# EasyEDA schematic LOVE LED CARD_2021-05-20.json
TITLE: Sheet_1; REV: 1.0; Date: 2021-01-27; Sheet: 1/1; Drawn By: Kundi; Company: Your Company
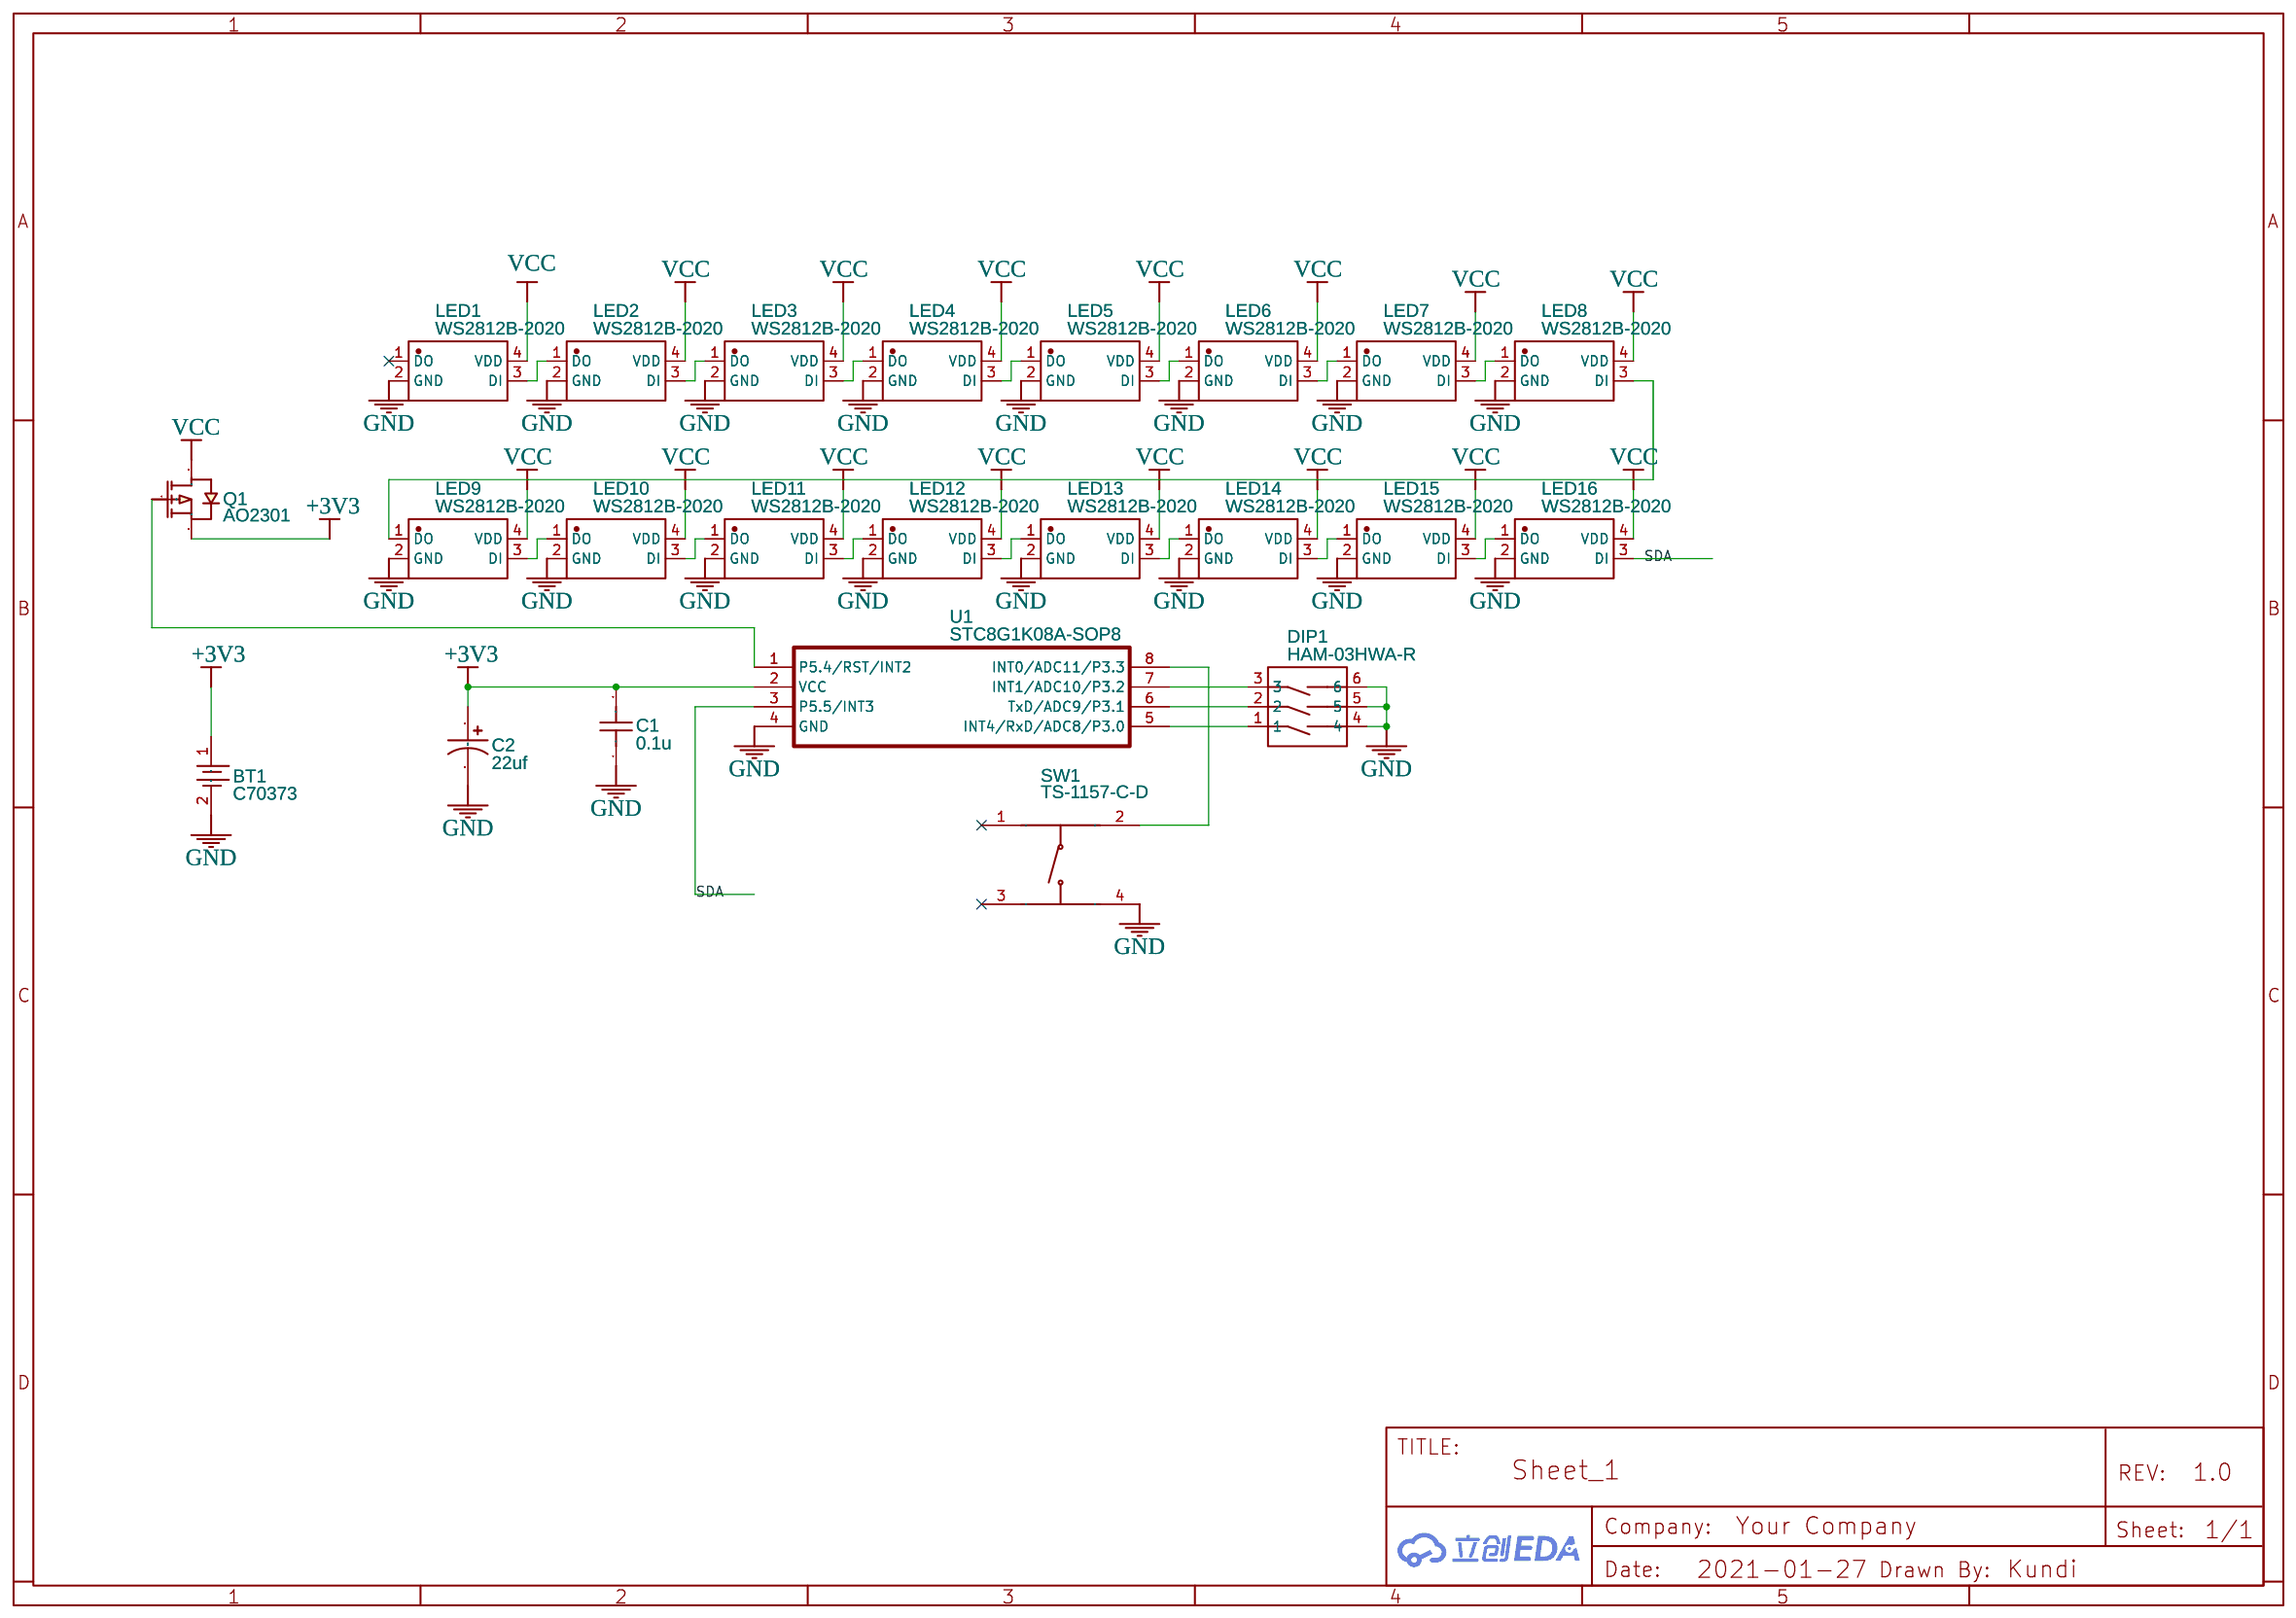
[diagram p0: schematic sheet]

## Parts
BT1  C70373  [BAT-SMD_CR2032-3V]
C1  0.1u  [C0805]
C2  22uf  [CASE-A_3216]
DIP1  HAM-03HWA-R  [SW-SMD_HAM-03HWA-R]
LED1  WS2812B-2020  [LED-SMD_4P-L2.0-W2.0-TL_WS2812B-2020]
LED2  WS2812B-2020  [LED-SMD_4P-L2.0-W2.0-TL_WS2812B-2020]
LED3  WS2812B-2020  [LED-SMD_4P-L2.0-W2.0-TL_WS2812B-2020]
LED4  WS2812B-2020  [LED-SMD_4P-L2.0-W2.0-TL_WS2812B-2020]
LED5  WS2812B-2020  [LED-SMD_4P-L2.0-W2.0-TL_WS2812B-2020]
LED6  WS2812B-2020  [LED-SMD_4P-L2.0-W2.0-TL_WS2812B-2020]
LED7  WS2812B-2020  [LED-SMD_4P-L2.0-W2.0-TL_WS2812B-2020]
LED8  WS2812B-2020  [LED-SMD_4P-L2.0-W2.0-TL_WS2812B-2020]
LED9  WS2812B-2020  [LED-SMD_4P-L2.0-W2.0-TL_WS2812B-2020]
LED10  WS2812B-2020  [LED-SMD_4P-L2.0-W2.0-TL_WS2812B-2020]
LED11  WS2812B-2020  [LED-SMD_4P-L2.0-W2.0-TL_WS2812B-2020]
LED12  WS2812B-2020  [LED-SMD_4P-L2.0-W2.0-TL_WS2812B-2020]
LED13  WS2812B-2020  [LED-SMD_4P-L2.0-W2.0-TL_WS2812B-2020]
LED14  WS2812B-2020  [LED-SMD_4P-L2.0-W2.0-TL_WS2812B-2020]
LED15  WS2812B-2020  [LED-SMD_4P-L2.0-W2.0-TL_WS2812B-2020]
LED16  WS2812B-2020  [LED-SMD_4P-L2.0-W2.0-TL_WS2812B-2020]
Q1  AO2301  [SOT-23-3_L2.9-W1.6-P1.90-LS2.8-BR]
SW1  TS-1157-C-D  [SW-SMD_4P-L6.2-W6.5-P4.50-LS8.5]
U1  STC8G1K08A-SOP8  [STC8G1K08]

## Library data of the parts
BT1 = C70373: Supplier: LCSC; Manufacturer: Q&J; Contributor: LCSC
C1 = C_0805_US: Contributor: LCEDA_Lib
C2 = C_Tan_SMD_A_US: Contributor: LCEDA_Lib
DIP1 = HAM-03HWA-R: Supplier: LCSC; Manufacturer: ReliaPro; image: //image.lceda.cn/szlcsc/C4666.jpg; Supplier Part: C4666; JLCPCB SMD: Yes; SMT Type: Extend
LED1-LED16 = WS2812B-2020: Supplier: LCSC; Supplier Part: C965555; Manufacturer: Worldsemi; Contributor: LCSC; JLCPCB SMD: Yes; SMT Type: Extend
Q1 = AO2301: Supplier: LCSC; Supplier Part: C693104; Manufacturer: VBsemi Elec; Contributor: LCSC; SMT Type: Extend; JLCPCB SMD: Yes
SW1 = TS-1157-C-D: Supplier: LCSC; Supplier Part: C609868; Manufacturer: XKB Enterprise; Contributor: LCSC; JLCPCB SMD: Yes; SMT Type: Extend
U1 = STC8G1K08A-SOP8: Manufacturer: STC; Supplier: STC; Contributor: Abner5

## Nets
+3V3: BT1.1 C1.2 C2.1 Q1.2(S) U1.2(VCC)
GND: BT1.2 C1.1 C2.2 DIP1.4 DIP1.5 DIP1.6 LED1.2(GND) LED2.2(GND) LED3.2(GND) LED4.2(GND) LED5.2(GND) LED6.2(GND) LED7.2(GND) LED8.2(GND) LED9.2(GND) LED10.2(GND) LED11.2(GND) LED12.2(GND) LED13.2(GND) LED14.2(GND) LED15.2(GND) LED16.2(GND) SW1.4(D) U1.4(GND)
VCC: LED1.4(VDD) LED2.4(VDD) LED3.4(VDD) LED4.4(VDD) LED5.4(VDD) LED6.4(VDD) LED7.4(VDD) LED8.4(VDD) LED9.4(VDD) LED10.4(VDD) LED11.4(VDD) LED12.4(VDD) LED13.4(VDD) LED14.4(VDD) LED15.4(VDD) LED16.4(VDD) Q1.3(D)
SDA: LED16.3(DI) U1.3(P5.5/INT3)
Net-(DIP1-1): DIP1.1 U1.5(INT4/RxD/ADC8/P3.0)
Net-(DIP1-2): DIP1.2 U1.6(TxD/ADC9/P3.1)
Net-(DIP1-3): DIP1.3 U1.7(INT1/ADC10/P3.2)
Net-(LED1-3): LED1.3(DI) LED2.1(DO)
Net-(LED2-3): LED2.3(DI) LED3.1(DO)
Net-(LED3-3): LED3.3(DI) LED4.1(DO)
Net-(LED4-3): LED4.3(DI) LED5.1(DO)
Net-(LED5-3): LED5.3(DI) LED6.1(DO)
Net-(LED6-3): LED6.3(DI) LED7.1(DO)
Net-(LED7-3): LED7.3(DI) LED8.1(DO)
Net-(LED8-3): LED8.3(DI) LED9.1(DO)
Net-(LED9-3): LED9.3(DI) LED10.1(DO)
Net-(LED10-3): LED10.3(DI) LED11.1(DO)
Net-(LED11-3): LED11.3(DI) LED12.1(DO)
Net-(LED12-3): LED12.3(DI) LED13.1(DO)
Net-(LED13-3): LED13.3(DI) LED14.1(DO)
Net-(LED14-3): LED14.3(DI) LED15.1(DO)
Net-(LED15-3): LED15.3(DI) LED16.1(DO)
Net-(Q1-1): Q1.1(G) U1.1(P5.4/RST/INT2)
Net-(SW1-2): SW1.2(B) U1.8(INT0/ADC11/P3.3)

Not connected (* = marked no-connect by the designer): LED1 1(DO)*; SW1 1(A)* 3(C)*
